# Altium schematic sheet EE3102_Project.SchDoc
size A; SheetNumber: 1; SheetTotal: 2
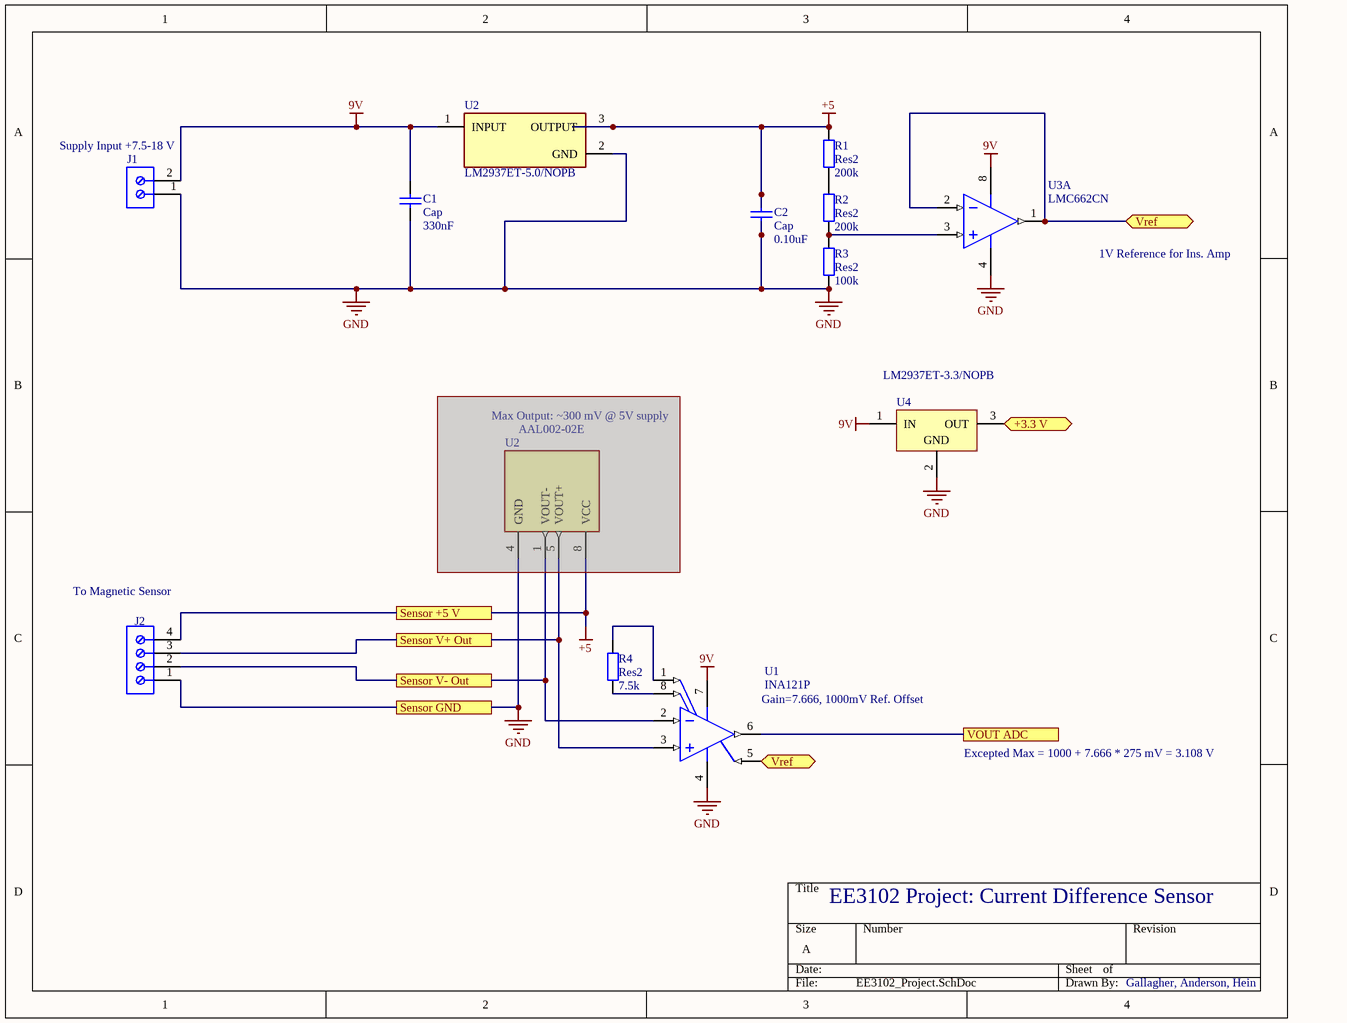
[diagram p0: EE3102_Project.SchDoc]

## Parts
(Parts that share a designator on the sheet are numbered #1, #2 ... from top to bottom, then left to right.)
C1  Cap  value 330nF  [RAD-0.3]
C2  Cap  value 0.10uF  [RAD-0.3]
J1  691137710002  [691137710002]  (value not drawn)
J2  691210910004  [691210910004]  (value not drawn)
R1  Res2  value 200k  [AXIAL-0.4]
R2  Res2  value 200k  [AXIAL-0.4]
R3  Res2  value 100k  [AXIAL-0.4]
R4  Res2  value 7.5k  [AXIAL-0.4]
U1  INA121P  [P0008A]
U2#1  LM2937ET-5.0/NOPB  [FP-NDE0003B-MFG]
U2#2  AAL002-02E  [Sensor_Socket_8]  (masked out: inside a compile mask, not in the netlist)
U3  LMC662CN  [N08E]  (part A of 2)
U4  LM2937ET-3.3/NOPB  [NDE0003A]

## Ports
+3.3 V (bidir), Sensor +5 V, Sensor GND, Sensor V+ Out, Sensor V- Out, VOUT ADC, Vref (bidir)

## Nets
9V: C1.2 J1.2(GND) U1.7(V+) U2#1.1(INPUT) U3.8(V+) U4.1(IN)
+5: C2.2 J2.4 R1.2 U2#1.3(OUTPUT) ; port Sensor +5 V
GND: C1.1 C2.1 J1.1(+7.5V_-_35V) J2.1 R3.1 U1.4(V-) U2#1.2(GND) U3.4(V-) U4.2(GND) ; port Sensor GND
+3.3 V: U4.3(OUT) ; port +3.3 V
Sensor V+ Out: J2.3 U1.3(VIN+) ; port Sensor V+ Out
Sensor V- Out: J2.2 U1.2(VIN-) ; port Sensor V- Out
VOUT ADC: U1.6(VO) ; port VOUT ADC
Vref: U1.5(REF) U3.1(OUTA) U3.2(INA-) ; port Vref
NetR1_1: R1.1 R2.2
NetR2_1: R2.1 R3.2 U3.3(INA+)
NetR4_1: R4.1 U1.8(RG)
NetR4_2: R4.2 U1.1(RG)

## Notes on the sheet
- (near J1) Supply Input +7.5-18 V
- 1V Reference for Ins. Amp
- Max Output: ~300 mV @ 5V supply
- (near J2) To Magnetic Sensor
- (near U1) Gain=7.666, 1000mV Ref. Offset
- Excepted Max = 1000 + 7.666 * 275 mV = 3.108 V
- EE3102 Project: Current Difference Sensor
- Gallagher, Anderson, Hein

## Library data of the parts
C1 C2 = Cap: Capacitor; Published: 8-Jun-2000; LatestRevisionDate: 17-Jul-2002; LatestRevisionNote: Re-released for DXP Platform.; PackageReference: RAD-0.3; Publisher: Altium Limited; PackageDescription: Radial Cap, Thru-Hole; 2 Leads; 0.3 in Pin Spacing
J1 = CMP-1502-03324-1: Series 1377 - 5.00 mm Horizontal Entry with Pressure Clamp WR-TBL, 2 pin; Manufacturer: Wurth Elektronik; Pin Number: 2; Pitch: 5.00mm; Operating Temperature: -30to120degC; Package Reference: 691137710002; Publisher: WurthElektronik; Mounting Technology: THT; Manufacturer URL: http://www.we-online.de; Packaging: Box; Part Number: 691137710002; Datasheet URL: http://katalog.we-online.de/pbs/datasheet/691137710002.pdf
J2 = CMP-1502-02458-1: Serie 2109 - 2.54 mm Horizontal Entry with Rising Cage Clamp WR-TBL, 4 pin; Manufacturer: Wurth Elektronik; Pin Number: 4; Pitch: 2.54mm; Mounting Technology: THT; Datasheet URL: http://katalog.we-online.de/em/datasheet/6912109100xx.pdf; Manufacturer URL: http://www.we-online.de; Operating Temperature: -40to105degC; Publisher: WurthElektronik; Package Reference: 691210910004; Part Number: 691210910004; Packaging: Box
R1-R4 = Res2: Resistor; Published: 8-Jun-2000; LatestRevisionDate: 17-Jul-2002; LatestRevisionNote: Re-released for DXP Platform.; PackageReference: AXIAL-0.4; Publisher: Altium Limited; PackageDescription: Axial Device, Thru-Hole; 2 Leads; 0.4 in Pin Spacing
U1 = CMP-0992-00127-2: FET-Input, Low Power Instrumentation Amplifier, -40 to 85 degC, 8-pin DIP (P8), Green (RoHS & no Sb/Br); Manufacturer: Texas Instruments; Input Bias Current (+/-)(Max)(nA): 0.05; SubFamily: Dual Supply; Input Offset Drift (+/-)(Max)(uV/Degrees Celsius): 5; Input Offset (+/-)(Max)(uV): 500; Quiescent Current (+/-)(Typ)(mA): 0.45; Non-Linearity (+/-)(Max)(%): 0.005; Number of Channels: 1; Noise at 1kHz(Typ)(nV/rt(Hz)): 20; CMRR(Min)(dB): 96; Output Offset Drift (+/-)(Max)(uV/Degrees Celsius): 20/G; Vs(Min)(V): 4.5; Gain(V/V): 1 to 10000; Output Offset (+/-)(Max)(uV): 500/G; Vs(Max)(V): 36; ComponentLink3URL: http://www.ti.com/litv/pdf/mpdi001b; ComponentLink3Description: Package Specification; Mounting Technology: Through Hole; ComponentLink2Description: Datasheet; PackageReference: P0008A; Code_JEDEC: MS-001; Eco-Plan: Green (RoHS & no Sb/Br); ComponentLink1URL: http://www.ti.com/; ComponentLink2URL: http://www.ti.com/general/docs/lit/getliterature.tsp?genericPartNumber=INA121&fileType=pdf; PartNumber: INA121P; ComponentLink1Description: Manufacturer URL; PackageDescription: 8-Pin Plastic In-Line, Body 9.59 x 6.35 mm, Pitch 2.54 mm; DatasheetVersion: SBOS078; PackageVersion: 4040082/E, 04/2010
U2#1 = CMP-0062-02519-4: IC REG LINEAR 5V 500MA TO220-3; Manufacturer: Texas Instruments; Standoff Height: 3.3mm; Max Supply Voltage: 26V; Min Supply Voltage: 6V; Max Junction Temp: +125°C; Number Of Outputs: 1; Accuracy Percentage: 5%; Dropout Voltage: 0.5V; Output Type: Fixed; Nominal Supply Current: 2-10mA; Output Voltage: 5V; Digikey Description: IC REG LINEAR 5V 500MA TO220-3; Temperature: -40°C to +125°C; Category: IC; Temperature Range High: +125°C; ComponentLink2Description: Datasheet; Package: NDE0003B; Manufacturer Part Number: LM2937ET-5.0/NOPB; ComponentLink2URL: http://www.ti.com/lit/ds/symlink/lm2937.pdf; Ipc Land Pattern Name: TO-220; Height: 19.55mm; Device Class L3: Voltage Regulators - Linear; Automotive: No; Octopart: https://octopart.com/lm2937et-5.0%2Fnopb-texas+instruments-24813532; Device Class L1: Integrated Circuits (ICs); Output Current: 500mA; RoHS: TRUE; Temperature Range Low: -40°C; Lead Free: Yes; Device Class L2: Power Management ICs
U2#2 = AAL002-02E: 1.5 mT Sat. Analog Sensor, 5.5 KOhm, RoHS SOIC; MF: NVE; Package: SOIC-8 NVE; SnapEDA_Link: https://www.snapeda.com/parts/AAL002-02E/NVE/view-part/75689/?ref=snap; Value: *; Price: None; MP: AAL002-02E; Availability: Unavailable
U3 = CMP-0055-00172-2: CMOS Dual Operational Amplifier, 8-pin MDIP; Manufacturer: National Semiconductor; PowerWise: N; CompType: Amplifiers; PackageTopMarking: NSUZXYTTE#*LMC*662CN; ComponentLink3Description: N08E Package Page; RoHS: N; ComponentLink3URL: http://www.national.com/packaging/folders/n08e.html; PackageReference: N08E; ComponentLink1URL: http://www.national.com/ds/LM/LMC662.pdf; ComponentLink2Description: LMC662 Web Page; DatasheetVersion: Apr-2003; ComponentLink2URL: http://www.national.com/pf/LM/LMC662.html; PinCount: 8; PackageDescription: MDIP, .365 x .250 x .130in, 8 Lead, .100in Pitch; Code_JEDEC: MS-001-BA; RevisionNote: Component URLs added; ComponentLink1Description: LMC662 Datasheet; PackageVersion: revG, May-2006
U4 = CMP-0062-02520-3: 400mA and 500mA Voltage Regulator, 3-pin TO-220, Pb-Free; Manufacturer: Texas Instruments; CompType: LDO IC; PackageTopMarking: NSUZXYTTE#*LM2937ET*-3.3; PowerWise: N; RoHS: Y; PinCount: 3; PackageDescription: TO-220, Molded, 3 Lead, Straight; ComponentLink1Description: Datasheet URL; ComponentLink1URL: http://www.ti.com/general/docs/lit/getliterature.tsp?genericPartNumber=LM2937-3.3&fileType=pdf; PackageReference: NDE0003A